# Altium schematic sheet Netscale48HD_Sensorbar.SchDoc: Sensorbar Master Overall Schematic
size A3; CompanyName: Reichle & De-Massari; Organization: Reichle & De-Massari; Address1: Binzstrasse 32; Address2: 8620 Wetzikon; Address3: Switzerland; DocumentNumber: 1; Revision: V0.2; SheetNumber: 1; SheetTotal: 5
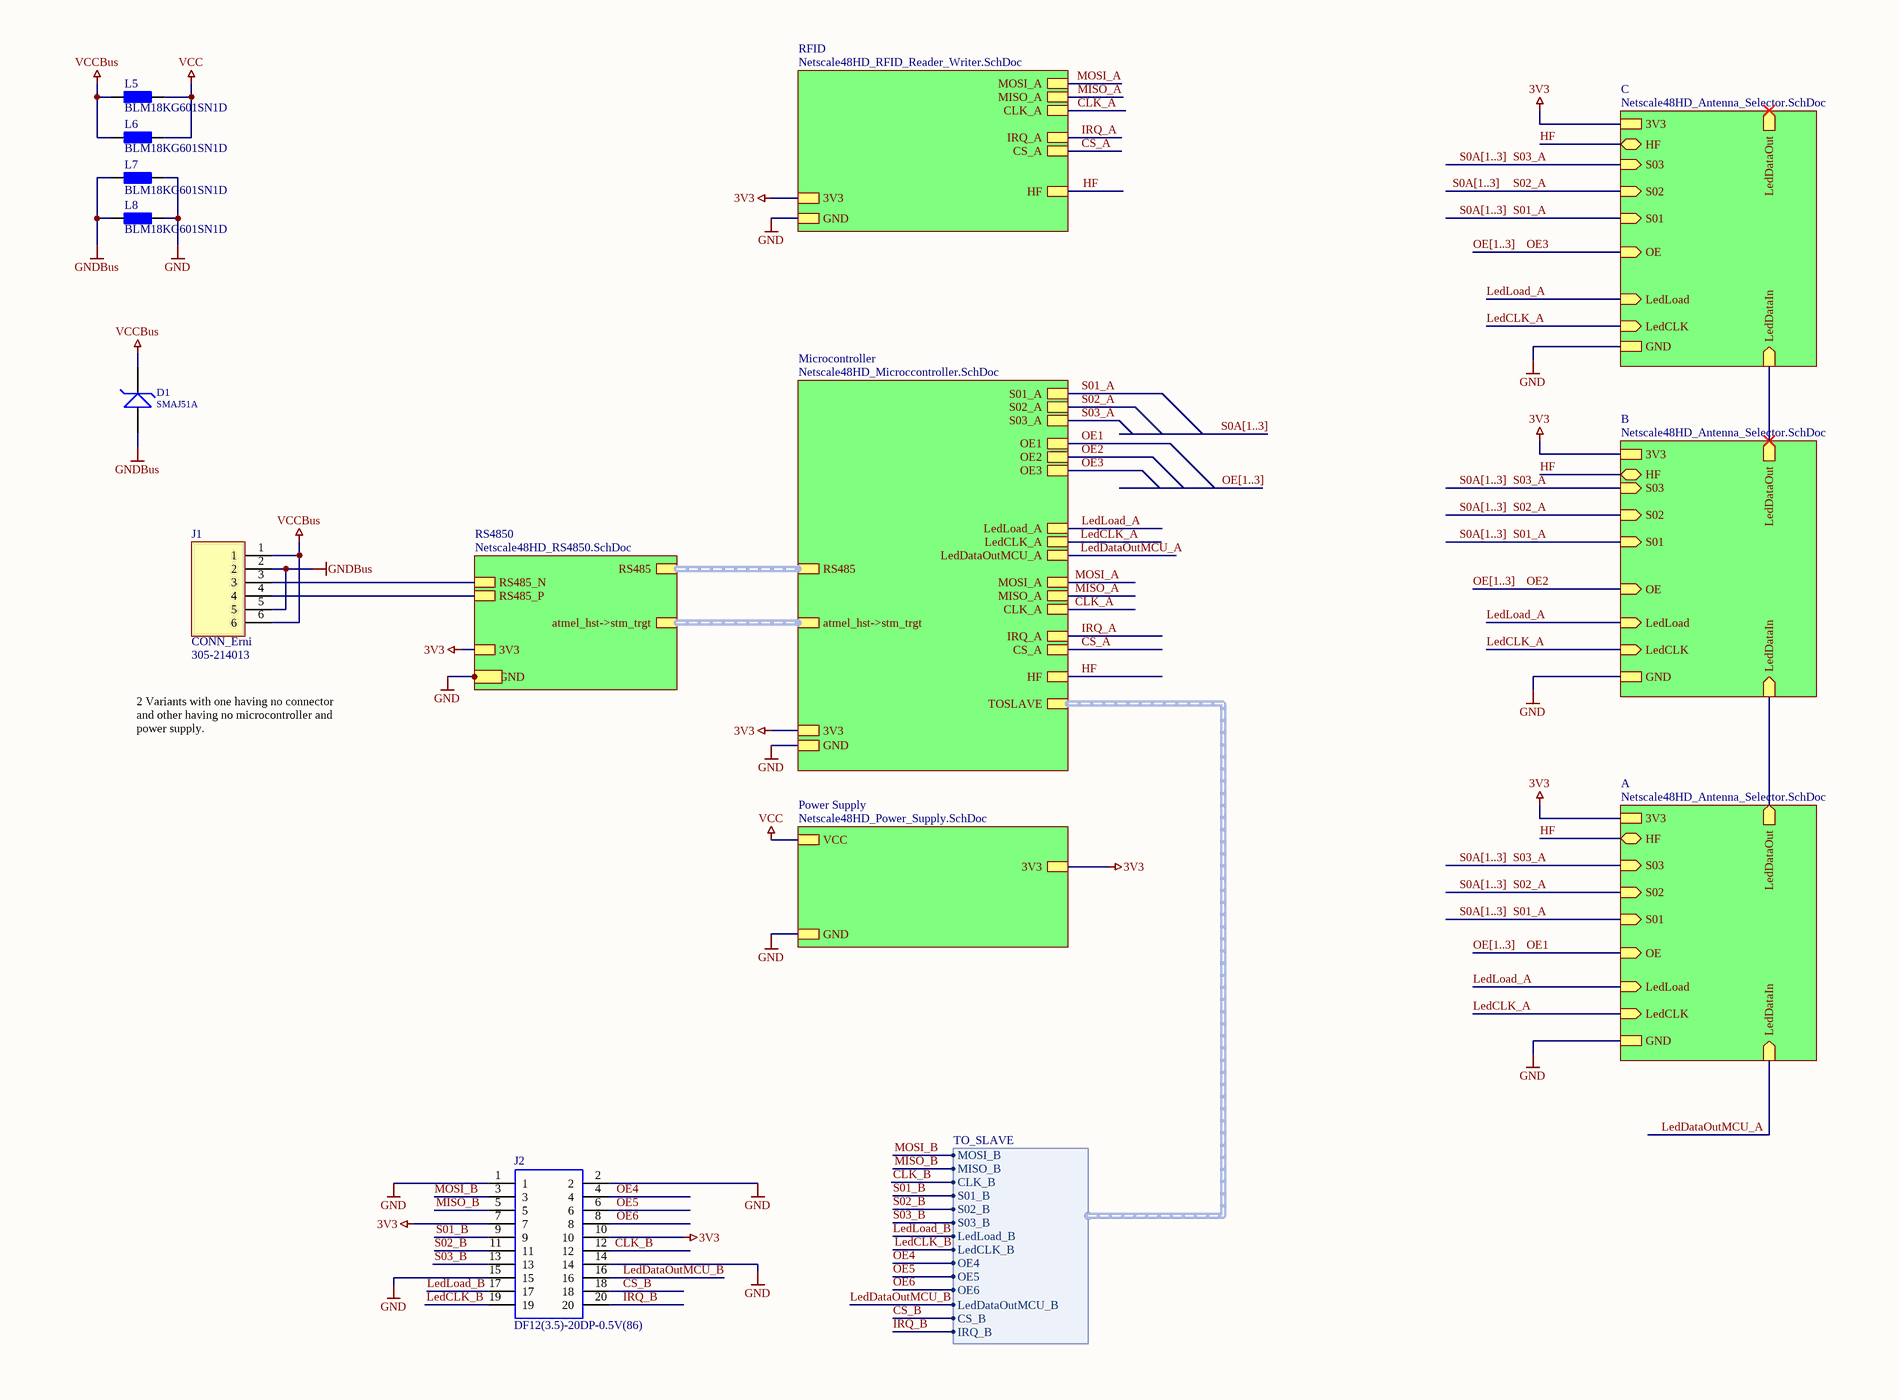
[diagram p0: Netscale48HD_Sensorbar.SchDoc, top]

## Parts
D1  SMAJ51A  [Bourns_DO-214AC (SMA) small_2_R]
J1  CONN_Erni  Supplier Part Number 1: 305-214013  [ERNI_214013 Randmontage_6_R]
J2  DF12(3.5)-20DP-0.5V(86)  [DF12(4.0)-20DP]
L5  BLM18KG601SN1D  [CAP-0603[1608] - RFL]
L6  BLM18KG601SN1D  [CAP-0603[1608] - RFL]
L7  BLM18KG601SN1D  [CAP-0603[1608] - RFL]
L8  BLM18KG601SN1D  [CAP-0603[1608] - RFL]

## Sub-sheets
A = Netscale48HD_Antenna_Selector.SchDoc: 3V3, S03 (in), S02 (in), S01 (in), HF (bidir), LedLoad (in), LedCLK (in), GND, LedDataOut (out), LedDataIn (in), OE (in)
B = Netscale48HD_Antenna_Selector.SchDoc: 3V3, S03 (in), S02 (in), S01 (in), HF (bidir), LedLoad (in), LedCLK (in), GND, LedDataOut (out), LedDataIn (in), OE (in)
C = Netscale48HD_Antenna_Selector.SchDoc: 3V3, S03 (in), S02 (in), S01 (in), HF (bidir), LedLoad (in), LedCLK (in), GND, LedDataOut (out), LedDataIn (in), OE (in)
Microcontroller = Netscale48HD_Microccontroller.SchDoc: GND, LedLoad_A, RS485 (harness RS485), 3V3, LedCLK_A, LedDataOutMCU_A, CS_A, S01_A, S02_A, S03_A, OE1, OE2, OE3, IRQ_A, HF, atmel_hst->stm_trgt (harness atmel_hst->stm_trgt), MOSI_A, MISO_A, CLK_A, TOSLAVE (harness TO_SLAVE)
Power Supply = Netscale48HD_Power_Supply.SchDoc: VCC, GND, 3V3
RFID = Netscale48HD_RFID_Reader_Writer.SchDoc: MOSI_A, MISO_A, 3V3, GND, IRQ_A, HF, CS_A, CLK_A
RS4850 = Netscale48HD_RS4850.SchDoc: GND, 3V3, RS485 (harness RS485), RS485_N, RS485_P, atmel_hst->stm_trgt (harness atmel_hst->stm_trgt)

## Ports


## Harnesses
TO_SLAVE: MOSI_B, MISO_B, CLK_B, S01_B, S02_B, S03_B, LedLoad_B, LedCLK_B, OE4, OE5, OE6, LedDataOutMCU_B, CS_B, IRQ_B

## Nets
3V3: J2.7 J2.10 ; sheet Microcontroller/3V3, sheet RS4850/3V3, sheet A/3V3, sheet B/3V3, sheet C/3V3, sheet RFID/3V3, sheet Power Supply/3V3
GND: J2.1 J2.2 J2.14 J2.15 L7.2 L8.2 ; port , sheet Microcontroller/GND, sheet RS4850/GND, sheet A/GND, sheet B/GND, sheet C/GND, sheet RFID/GND, sheet Power Supply/GND
GNDBus: D1.2(A) J1.2 J1.5 L7.1 L8.1
VCC: L5.2 L6.2 ; sheet Power Supply/VCC
VCCBus: D1.1(K) J1.1 J1.6 L5.1 L6.1
CLK_A: sheet Microcontroller/CLK_A, sheet RFID/CLK_A
CLK_B: J2.12 ; sheet Microcontroller/TOSLAVE.CLK_B
CS_A: sheet Microcontroller/CS_A, sheet RFID/CS_A
CS_B: J2.18 ; sheet Microcontroller/TOSLAVE.CS_B
HF: sheet Microcontroller/HF, sheet A/HF, sheet B/HF, sheet C/HF, sheet RFID/HF
IRQ_A: sheet Microcontroller/IRQ_A, sheet RFID/IRQ_A
IRQ_B: J2.20 ; sheet Microcontroller/TOSLAVE.IRQ_B
LedCLK_A: sheet Microcontroller/LedCLK_A, sheet A/LedCLK, sheet B/LedCLK, sheet C/LedCLK
LedCLK_B: J2.19 ; sheet Microcontroller/TOSLAVE.LedCLK_B
LedDataOutMCU_A: sheet Microcontroller/LedDataOutMCU_A, sheet A/LedDataIn
LedDataOutMCU_B: J2.16 ; sheet Microcontroller/TOSLAVE.LedDataOutMCU_B
LedLoad_A: sheet Microcontroller/LedLoad_A, sheet A/LedLoad, sheet B/LedLoad, sheet C/LedLoad
LedLoad_B: J2.17 ; sheet Microcontroller/TOSLAVE.LedLoad_B
MISO_A: sheet Microcontroller/MISO_A, sheet RFID/MISO_A
MISO_B: J2.5 ; sheet Microcontroller/TOSLAVE.MISO_B
MOSI_A: sheet Microcontroller/MOSI_A, sheet RFID/MOSI_A
MOSI_B: J2.3 ; sheet Microcontroller/TOSLAVE.MOSI_B
OE1: sheet Microcontroller/OE1, sheet A/OE
OE2: sheet Microcontroller/OE2, sheet B/OE
OE3: sheet Microcontroller/OE3, sheet C/OE
OE4: J2.4 ; sheet Microcontroller/TOSLAVE.OE4
OE5: J2.6 ; sheet Microcontroller/TOSLAVE.OE5
OE6: J2.8 ; sheet Microcontroller/TOSLAVE.OE6
S01_A: sheet Microcontroller/S01_A, sheet A/S01, sheet B/S01, sheet C/S01
S01_B: J2.9 ; sheet Microcontroller/TOSLAVE.S01_B
S02_A: sheet Microcontroller/S02_A, sheet A/S02, sheet B/S02, sheet C/S02
S02_B: J2.11 ; sheet Microcontroller/TOSLAVE.S02_B
S03_A: sheet Microcontroller/S03_A, sheet A/S03, sheet B/S03, sheet C/S03
S03_B: J2.13 ; sheet Microcontroller/TOSLAVE.S03_B
NetJ1_3: J1.3 ; sheet RS4850/RS485_N
NetJ1_4: J1.4 ; sheet RS4850/RS485_P
(unnamed): sheet A/LedDataOut, sheet B/LedDataIn
(unnamed): sheet B/LedDataOut, sheet C/LedDataIn

## Buses and harness runs
bus OE[1..3]
bus S0A[1..3]
harness sheet Microcontroller/atmel_hst->stm_trgt = sheet RS4850/atmel_hst->stm_trgt
harness sheet Microcontroller/RS485 = sheet RS4850/RS485

## Notes on the sheet
- 10,8
- 16,8
- 7
- 212,4
- 2 Variants with one having no connector and other having no microcontroller and power supply.
- Title
- Size:
- Date:
- A3
- Number:
- Time:
- Revision:
- Sheet
- of
- File:

## Library data of the parts
D1 = Diode_SMAJ51A: ESD Suppressors / TVS Diodes 51volts 5uA 4.9 Amps Uni-Dir; Manufacturer: Bourns; Replaceable: yes; Manufacturer PartNr: SMAJ51A; ShortDescription: SMAJ51A; Footprint/Package: DO-214AC-2 (SMA); Supplier 1: Mouser; Supplier Part Number 1: 652-SMAJ51A; value: SMAJ51A
J1 = CONN_Erni_6_214013: Headers & Wire Housings 6P 1.27MM SNGL ROW R/A MALE BLK; Manufacturer: ERNI; Manufacturer PartNr: 214013; Replaceable: no; ComponentLink1Description: mouser; ComponentLink1URL: https://www.mouser.ch/ProductDetail/ERNI/214013?qs=sGAEpiMZZMvMXbh32ZmHAMhEPQG9jaj7Ou3J%2fuOb4IQ%3d; Footprint/Package: 1.27mm; Supplier 1: Mouser
J2 = DF12(3.5)-20DP-0.5V(86): Connector,Board to Board,DF12 Hirose DF12 Series, 0.5mm Pitch 20 Way 2 Row Straight PCB Header, Solder Termination, 0.3A; Allied_Number: R1051072; Manufacturer_Name: Hirose; Manufacturer_Part_Number: DF12(3.5)-20DP-0.5V(86); RS Part Number: 6082064P; RS Price/Stock: http://uk.rs-online.com/web/p/products/6082064P; Allied Price/Stock: http://www.alliedelec.com/hirose-electric-df12-3-5-20dp-0-5v-86-/R1051072/; Mouser Part Number: 798-DF123520DP0.5V86; Mouser Price/Stock: https://www.mouser.com/Search/Refine.aspx?Keyword=798-DF123520DP0.5V86; Datasheet Link: https://www.hirose.com/product/en/download_file/key_name/DF12/category/Catalog/doc_file_id/31693/?file_category_id=4&item_id=23&is_series=1.pdf; Supplier 1: Digi-Key; Supplier 1 Part Number 1: H5230TR-ND
L5-L8 = Ferrite Beads: Chip Ferrite Bead; Manufacturer: Murata; Manufacturer PartNr: BLM18KG601SN1D; ShortDescription: BLM18KG601SN1D